# Altium schematic sheet SCH_02_Power_Diagram.SchDoc
size A4; DrawnBy: Phung Nhat Minh; SheetNumber: 2; SheetTotal: 7
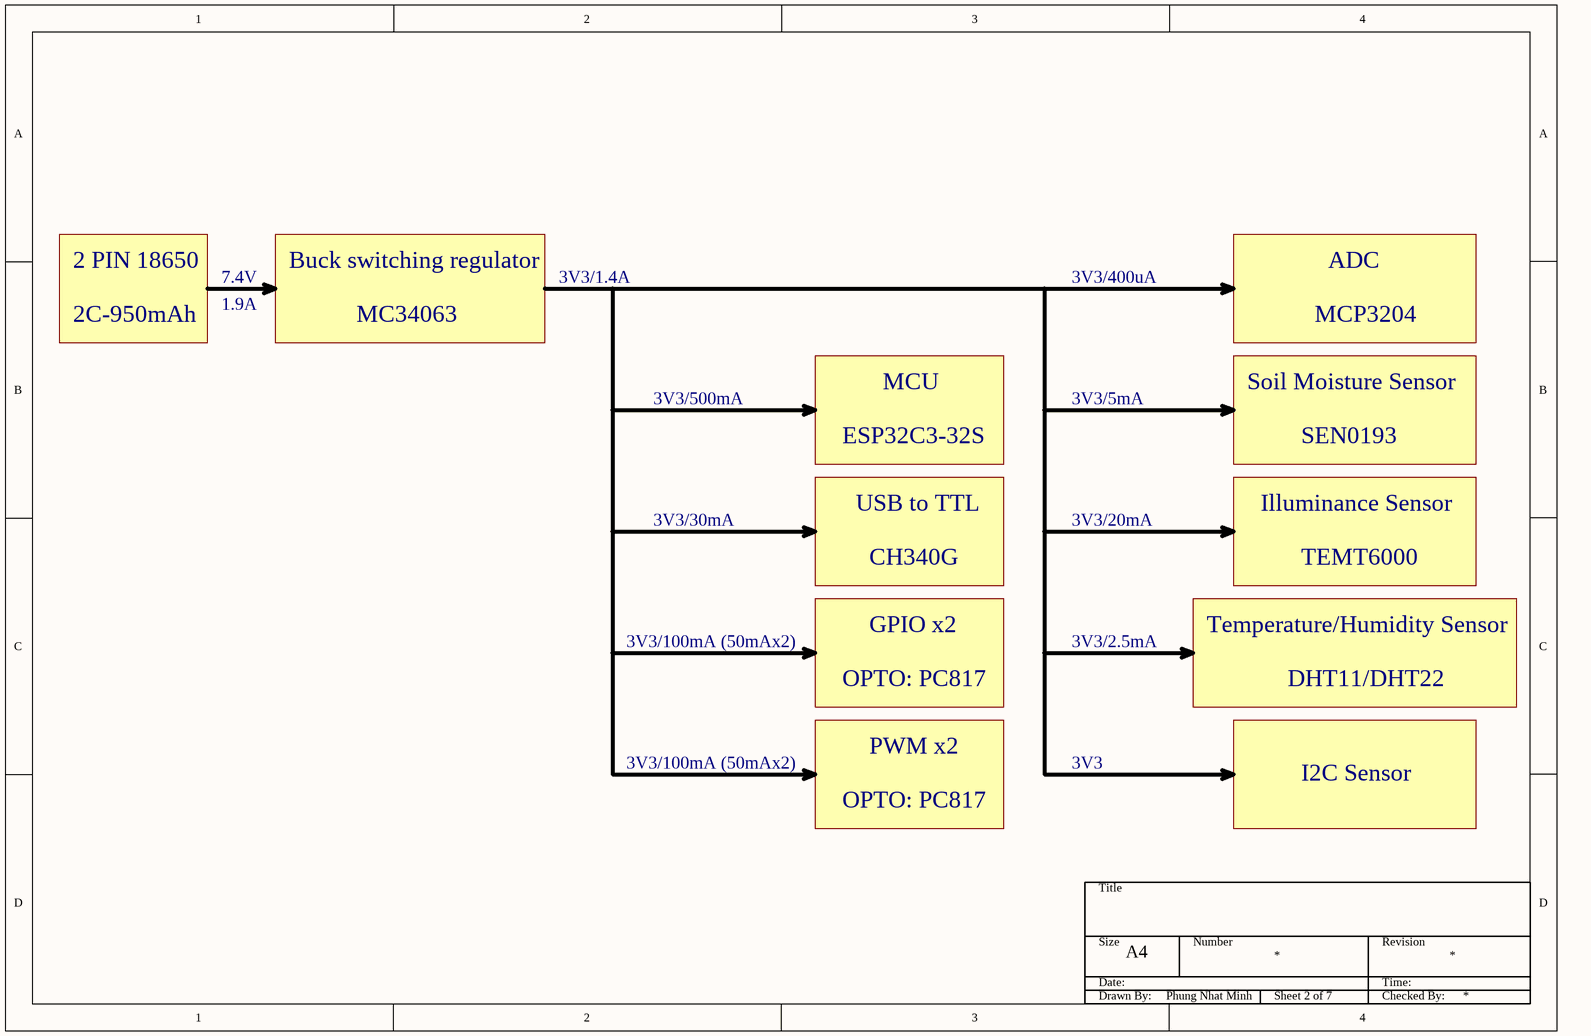
[diagram p0: SCH_02_Power_Diagram.SchDoc]

## Notes on the sheet
- 2 PIN 18650
- 7.4V
- 1.9A
- Buck switching regulator
- 3V3/1.4A
- 3V3/400uA
- ADC
- 2C-950mAh
- MC34063
- MCP3204
- 3V3/500mA
- ESP32C3-32S
- MCU
- 3V3/5mA
- Soil Moisture Sensor
- SEN0193
- USB to TTL
- Illuminance Sensor
- 3V3/30mA
- CH340G
- 3V3/20mA
- TEMT6000
- 3V3/100mA (50mAx2)
- GPIO x2
- 3V3/2.5mA
- Temperature/Humidity Sensor
- OPTO: PC817
- DHT11/DHT22
- PWM x2
- 3V3
- I2C Sensor
- Title
- Size
- Date:
- A4
- Number
- Revision
- Time:
- Drawn By:
- Checked By: